# EAGLE schematic BLE -- HM-10 -- Breakout v.9.2 (EAGLE 6.4)
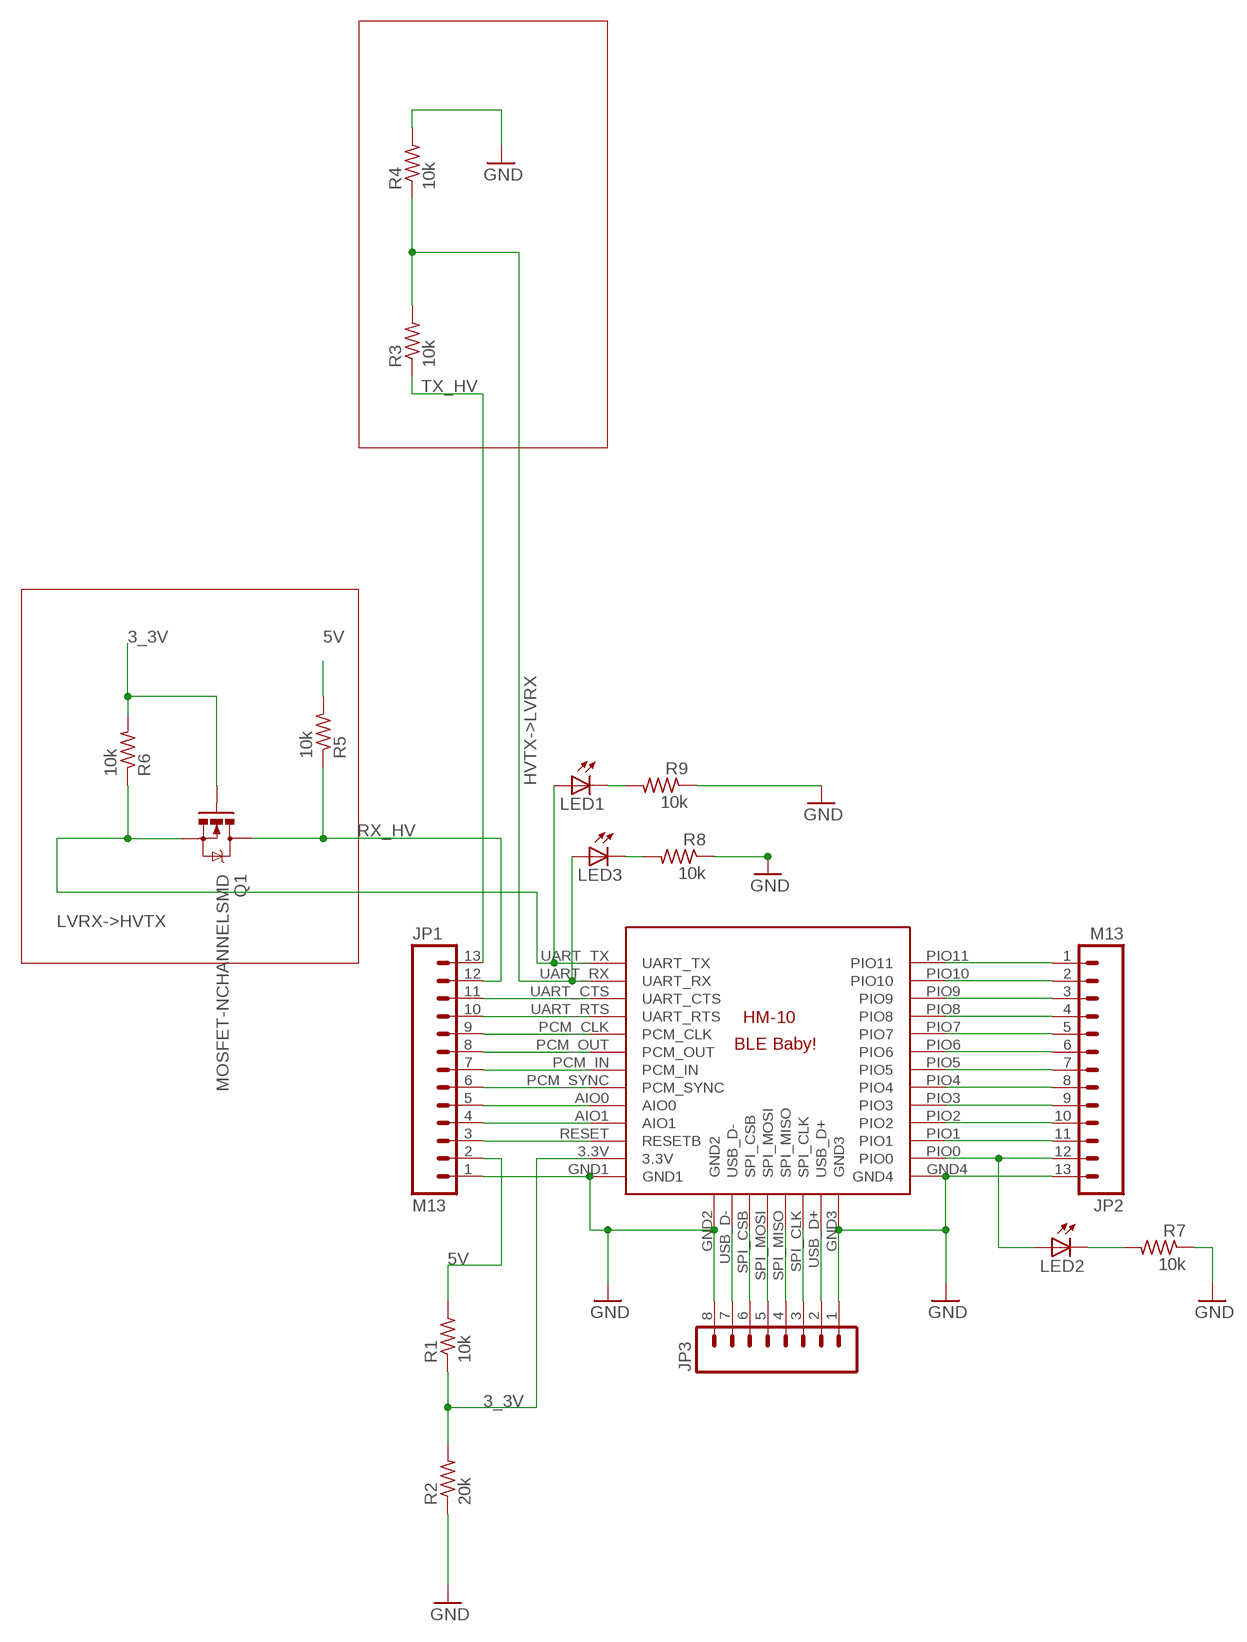
[diagram p0: schematic, sheet 1]

## Parts
JP1  M13  [1X13]
JP2  M13  [1X13]
JP3  M081X08  [1X08]
LED1  LED0603  [LED-0603]
LED2  LED0603  [LED-0603]
LED3  LED0603  [LED-0603]
Q1  MOSFET-NCHANNELSMD  [SOT23-3]
R1  10k  R-US_M0805  [M0805]
R2  20k  R-US_M0805  [M0805]
R3  10k  R-US_M0805  [M0805]
R4  10k  R-US_M0805  [M0805]
R5  10k  R-US_M0805  [M0805]
R6  10k  R-US_M0805  [M0805]
R7  10k  R-US_M0805  [M0805]
R8  10k  R-US_M0805  [M0805]
R9  10k  R-US_M0805  [M0805]
U$1  BLE-HM-10  [BLE-HM-10]

## Nets
3_3V: Q1.1(G) R1.1 R2.2 R6.2 U$1.3.3V
5V: JP1.2 R1.2 R5.2
GND: JP1.1 JP2.13 JP3.1 JP3.8 R2.1 R4.2 R7.1 R8.1 R9.1 U$1.GND1 U$1.GND2 U$1.GND3 U$1.GND4
HVTX->LVRX: LED3.A R3.2 R4.1 U$1.UART_RX
LVRX->HVTX: LED1.A Q1.2(S) R6.1 U$1.UART_TX
N$3: JP1.3 U$1.RESET(RESETB)
N$4: JP1.4 U$1.AIO1
N$5: JP1.5 U$1.AIO0
N$6: JP1.6 U$1.PCM_SYNC
N$7: JP1.7 U$1.PCM_IN
N$8: JP1.8 U$1.PCM_OUT
N$9: JP1.9 U$1.PCM_CLK
N$10: JP1.10 U$1.UART_RTS
N$11: JP1.11 U$1.UART_CTS
N$14: JP2.1 U$1.PIO11
N$15: JP2.2 U$1.PIO10
N$16: JP2.3 U$1.PIO9
N$17: JP2.4 U$1.PIO8
N$18: JP2.5 U$1.PIO7
N$19: JP2.6 U$1.PIO6
N$20: JP2.7 U$1.PIO5
N$21: JP2.8 U$1.PIO4
N$22: JP2.9 U$1.PIO3
N$23: JP2.10 U$1.PIO2
N$24: JP2.11 U$1.PIO1
N$25: JP2.12 LED2.A U$1.PIO0
N$26: LED2.C R7.2
N$28: JP3.2 U$1.USB_D+
N$29: JP3.3 U$1.SPI_CLK
N$30: JP3.4 U$1.SPI_MISO
N$31: JP3.5 U$1.SPI_MOSI
N$32: JP3.6 U$1.SPI_CSB
N$33: JP3.7 U$1.USB_D-
N$34: LED1.C R9.2
N$35: LED3.C R8.2
RX_HV: JP1.12 Q1.3(D) R5.1
TX_HV: JP1.13 R3.1

## Library data of the parts
JP1 JP2 = SparkFun:M13
JP3 = SparkFun:M08: Header 8 Standard 8-pin 0.1" header. Use with straight break away headers (SKU : PRT-00116), right angle break away headers (PRT-00553), swiss pins (PRT-00743), machine pins (PRT-00117), and female headers (PRT-00115).
LED1-LED3 = SparkFun:LED: LEDs Standard schematic elements and footprints for 5mm, 3mm, 1206, and 0603 sized LEDs. 5mm - Spark Fun Electronics SKU : COM-00529 (and others)
Q1 = SparkFun:MOSFET-NCHANNEL
R1-R9 = resistor:R-US_: RESISTOR, American symbol
U$1 = Random parts:BLE-HM-10